# Altium schematic sheet Esquematico_MainBoard.SchDoc
size A4; SheetNumber: 1; SheetTotal: 1
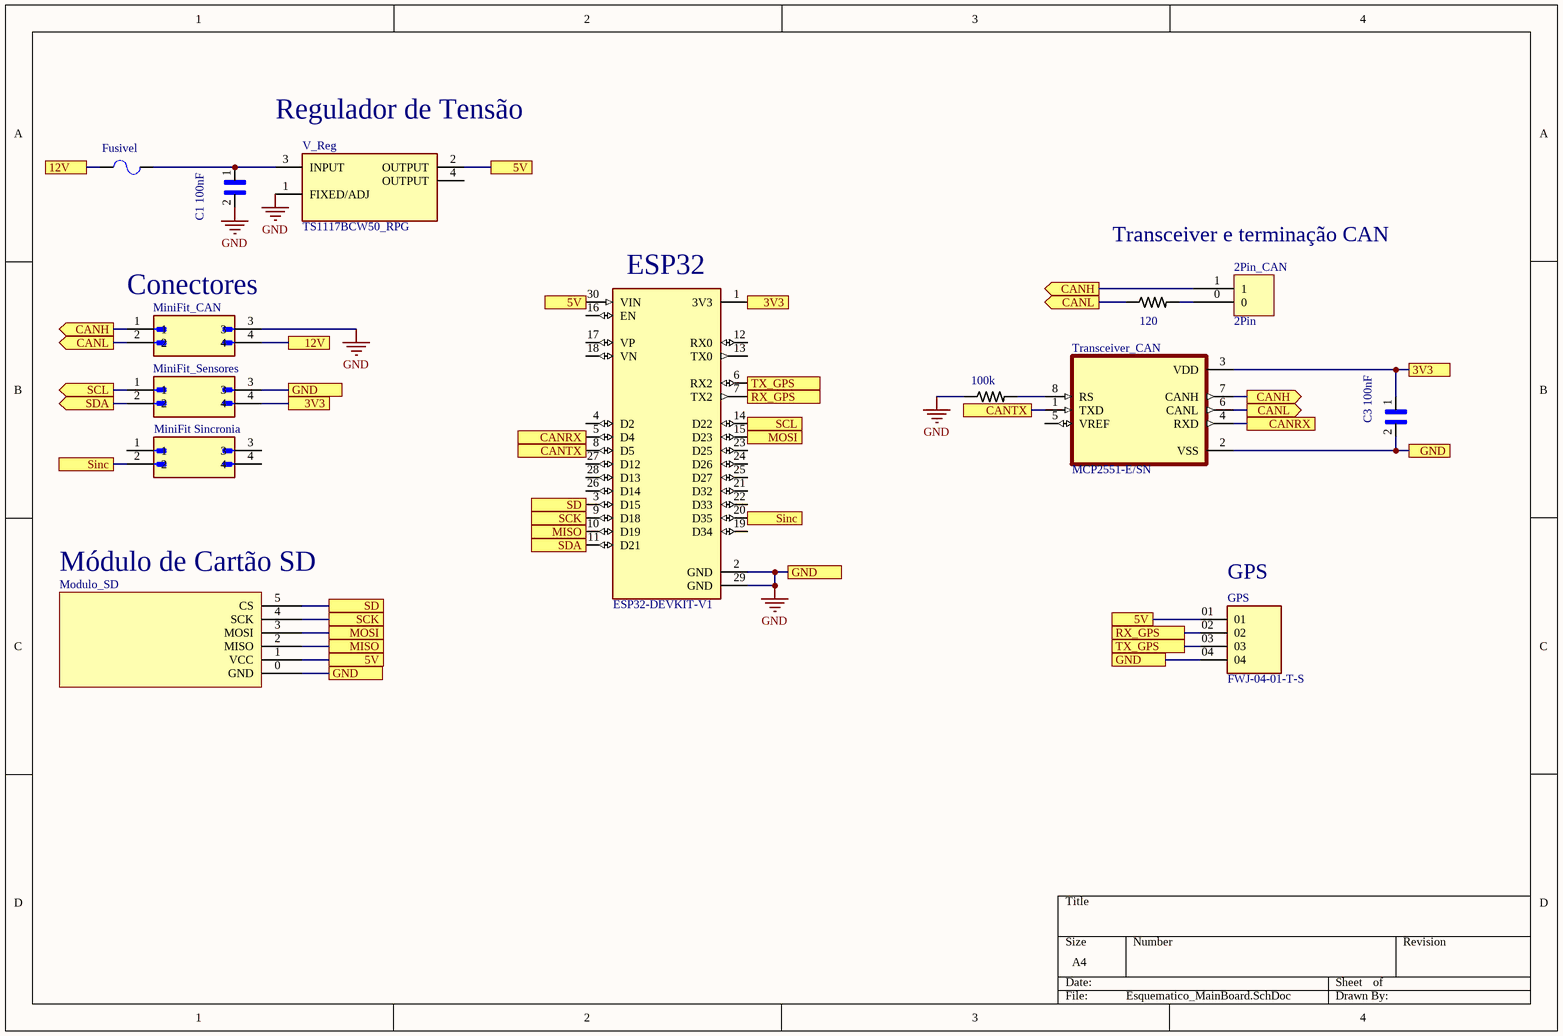
[diagram p0: Esquematico_MainBoard.SchDoc]

## Parts
2Pin_CAN  2Pin  [2Pin]
100k  CRG1206F620K  [RESC3115X65N]  (value not drawn)
120  CRG1206F620K  [RESC3115X65N]  (value not drawn)
?  ESP32-DEVKIT-V1  [MODULE_ESP32_DEVKIT_V1]
C1_100nF  C2012X5R1E225M085AC  [*CAPC2012X100N]  (value not drawn)
C3_100nF  C2012X5R1E225M085AC  [*CAPC2012X100N]  (value not drawn)
Fusivel  F1206B3R00FWTR  [*FUSM3216X140N]  (value not drawn)
GPS  FWJ-04-01-T-S  [SAMTEC_FWJ-04-01-T-S]
MiniFit_CAN  874270402  [MOLEX_874270402]  (value not drawn)
MiniFit_Sensores  874270402  [MOLEX_874270402]  (value not drawn)
MiniFit_Sincronia  874270402  [MOLEX_874270402]  (value not drawn)
Modulo_SD  Component_1  [MICROSD_MODULE]  (value not drawn)
Transceiver_CAN  MCP2551-E/SN  [SOIC127P600X175-8N]
V_Reg  TS1117BCW50_RPG  [VREG_TS1117BCW50_RPG]

## Ports
3V3, 5V, 12V, CANH (out), CANL (out), CANRX, CANTX, GND, MISO, MOSI, RX_GPS, SCK, SCL (out), SD, SDA (out), Sinc, TX_GPS

## Nets
GND: 100k.1 ?.2(GND) ?.29(GND) C1_100nF.2 C3_100nF.2 GPS.04 MiniFit_CAN.3 MiniFit_Sensores.3 Modulo_SD.0(GND) Transceiver_CAN.2(VSS) V_Reg.1(FIXED/ADJ) ; port GND
3V3: ?.1(3V3) C3_100nF.1 MiniFit_Sensores.4 Transceiver_CAN.3(VDD) ; port 3V3
5V: ?.30(VIN) GPS.01 Modulo_SD.1(VCC) V_Reg.2(OUTPUT) ; port 5V
12V: Fusivel.1 MiniFit_CAN.4 ; port 12V
CANH: 2Pin_CAN.1 MiniFit_CAN.1 Transceiver_CAN.7(CANH) ; port CANH
CANL: 120.1 MiniFit_CAN.2 Transceiver_CAN.6(CANL) ; port CANL
CANRX: ?.5(D4) Transceiver_CAN.4(RXD) ; port CANRX
CANTX: ?.8(D5) Transceiver_CAN.1(TXD) ; port CANTX
MISO: ?.10(D19) Modulo_SD.2(MISO) ; port MISO
MOSI: ?.15(D23) Modulo_SD.3(MOSI) ; port MOSI
RX_GPS: ?.7(TX2) GPS.02 ; port RX_GPS
SCK: ?.9(D18) Modulo_SD.4(SCK) ; port SCK
SCL: ?.14(D22) MiniFit_Sensores.1 ; port SCL
SD: ?.3(D15) Modulo_SD.5(CS) ; port SD
SDA: ?.11(D21) MiniFit_Sensores.2 ; port SDA
Sinc: ?.20(D35) MiniFit_Sincronia.2 ; port Sinc
TX_GPS: ?.6(RX2) GPS.03 ; port TX_GPS
Net2Pin_CAN_0: 2Pin_CAN.0 120.2
Net100k_2: 100k.2 Transceiver_CAN.8(RS)
NetC1_100nF_1: C1_100nF.1 Fusivel.2 V_Reg.3(INPUT)

Not connected (* = marked no-connect by the designer): ? 4(D2) 12(RX0) 13(TX0) 16(EN) 17(VP) 18(VN) 19(D34) 21(D32) 22(D33) 23(D25) 24(D26) 25(D27) 26(D14) 27(D12) 28(D13); MiniFit_Sincronia 1 3 4; Transceiver_CAN 5(VREF); V_Reg 4(OUTPUT)

## Notes on the sheet
- (near V_Reg) Regulador de Tensão
- Transceiver e terminação CAN
- (near MiniFit_CAN) Conectores
- ESP32
- (near Modulo_SD) Módulo de Cartão SD
- (near GPS) GPS

## Library data of the parts
100k 120 = CRG1206F620K: Res Thick Film 1206 620K Ohm 1% 0.25W_1/4W_ Â±100ppm/C Pad SMD T/R; MF: TE Connectivity; Package: 1206 TE Connectivity; Price: 0.00 USD; MP: CRG1206F620K; Availability: Unavailable; SnapEDA_Link: https://www.snapeda.com/parts/CRG1206F620K/TE%20Connectivity%20/%20DEUTSCH/view-part/?ref=snap; Value: *
? = ESP32-DEVKIT-V1: Dual core, Wi-Fi: 2.4 GHz up to 150 Mbits/s,BLE (Bluetooth Low Energy) and legacy Bluetooth, 32 bits, Up to 240 MHz; MF: Do it; Price: None; Availability: Not in stock; Package: None; MP: ESP32-DEVKIT-V1; Value: *; SnapEDA_Link: https://www.snapeda.com/parts/ESP32-DEVKIT-V1/Do+it/view-part/?ref=snap; Check_prices: https://www.snapeda.com/parts/ESP32-DEVKIT-V1/Do+it/view-part/?ref=eda
C1_100nF C3_100nF = C2012X5R1E225M085AC: Cap Ceramic 2.2uF 25V X5R 20% SMD 0805 85Â°C Punched Paper T/R; MF: TDK; Package: 0805 TDK; MP: C2012X5R1E225M085AC; Availability: Unavailable; Price: None; SnapEDA_Link: https://www.snapeda.com/parts/C2012X5R1E225M085AC/TDK/view-part/?ref=snap; Value: *
Fusivel = F1206B3R00FWTR: F1206B Series Fast Acting 63 V 3 A 1206 Surface Mount Thin-Film Fuse T&R; MF: AVX; SnapEDA_Link: https://www.snapeda.com/parts/F1206B3R00FWTR/AVX%20/%20Kyocera/view-part/?ref=snap; Package: 1206 AVX; MP: F1206B3R00FWTR; Availability: Unavailable; Price: None; Value: *
GPS = FWJ-04-01-T-S: Connector Header Through Hole 4 position 0.156 (3.96mm); MF: Samtec; Availability: Bad; Package: None; Check_prices: https://www.snapeda.com/parts/FWJ-04-01-T-S/Samtec/view-part/3573755/?ref=eda; Price: None; SnapEDA_Link: https://www.snapeda.com/parts/FWJ-04-01-T-S/Samtec/view-part/3573755/?ref=snap; MP: FWJ-04-01-T-S; Purchase-URL: https://pricing.snapeda.com/search/part/FWJ-04-01-T-S/?ref=eda; Value: *
MiniFit_CAN MiniFit_Sensores MiniFit_Sincronia = 874270402: Conn Wire to Board HDR 4 POS 4.2mm Solder RA Side Entry Thru-Hole Mini-Fit Jrâ„¢ Tray; MF: Molex; MP: 874270402; Package: None; SnapEDA_Link: https://www.snapeda.com/parts/874270402/Molex/view-part/?ref=snap; Check_prices: https://www.snapeda.com/parts/874270402/Molex/view-part/?ref=eda; Availability: In Stock; Value: *; Purchase-URL: https://pricing.snapeda.com/search/part/874270402/?ref=eda; Price: None
Transceiver_CAN = MCP2551-E/SN: 1/1 Transceiver Half CANbus 8-SOIC; MF: Microchip; Check_prices: https://www.snapeda.com/parts/MCP2551-E/SN/Microchip/view-part/?ref=eda; Value: *; Availability: In Stock; MP: MCP2551-E/SN; Price: None; Package: SOIC-8 Microchip; SnapEDA_Link: https://www.snapeda.com/parts/MCP2551-E/SN/Microchip/view-part/?ref=snap; Purchase-URL: https://pricing.snapeda.com/search/part/MCP2551-E/SN/?ref=eda
V_Reg = TS1117BCW50_RPG: 1A 5V LOW DROPOUT VOLTAGE REGULATOR; MP: TS1117BCW50 RPG; MF: Taiwan Semiconductor; Availability: In Stock; Check_prices: https://www.snapeda.com/parts/TS1117BCW50%20RPG/Taiwan+Semiconductor/view-part/?ref=eda; Purchase-URL: https://pricing.snapeda.com/search/part/TS1117BCW50 RPG/?ref=eda; SnapEDA_Link: https://www.snapeda.com/parts/TS1117BCW50%20RPG/Taiwan+Semiconductor/view-part/?ref=snap; Value: *; Price: None; Package: SOT-223 Taiwan Semiconductor